# EAGLE design project1 (EAGLE 7.2.0)
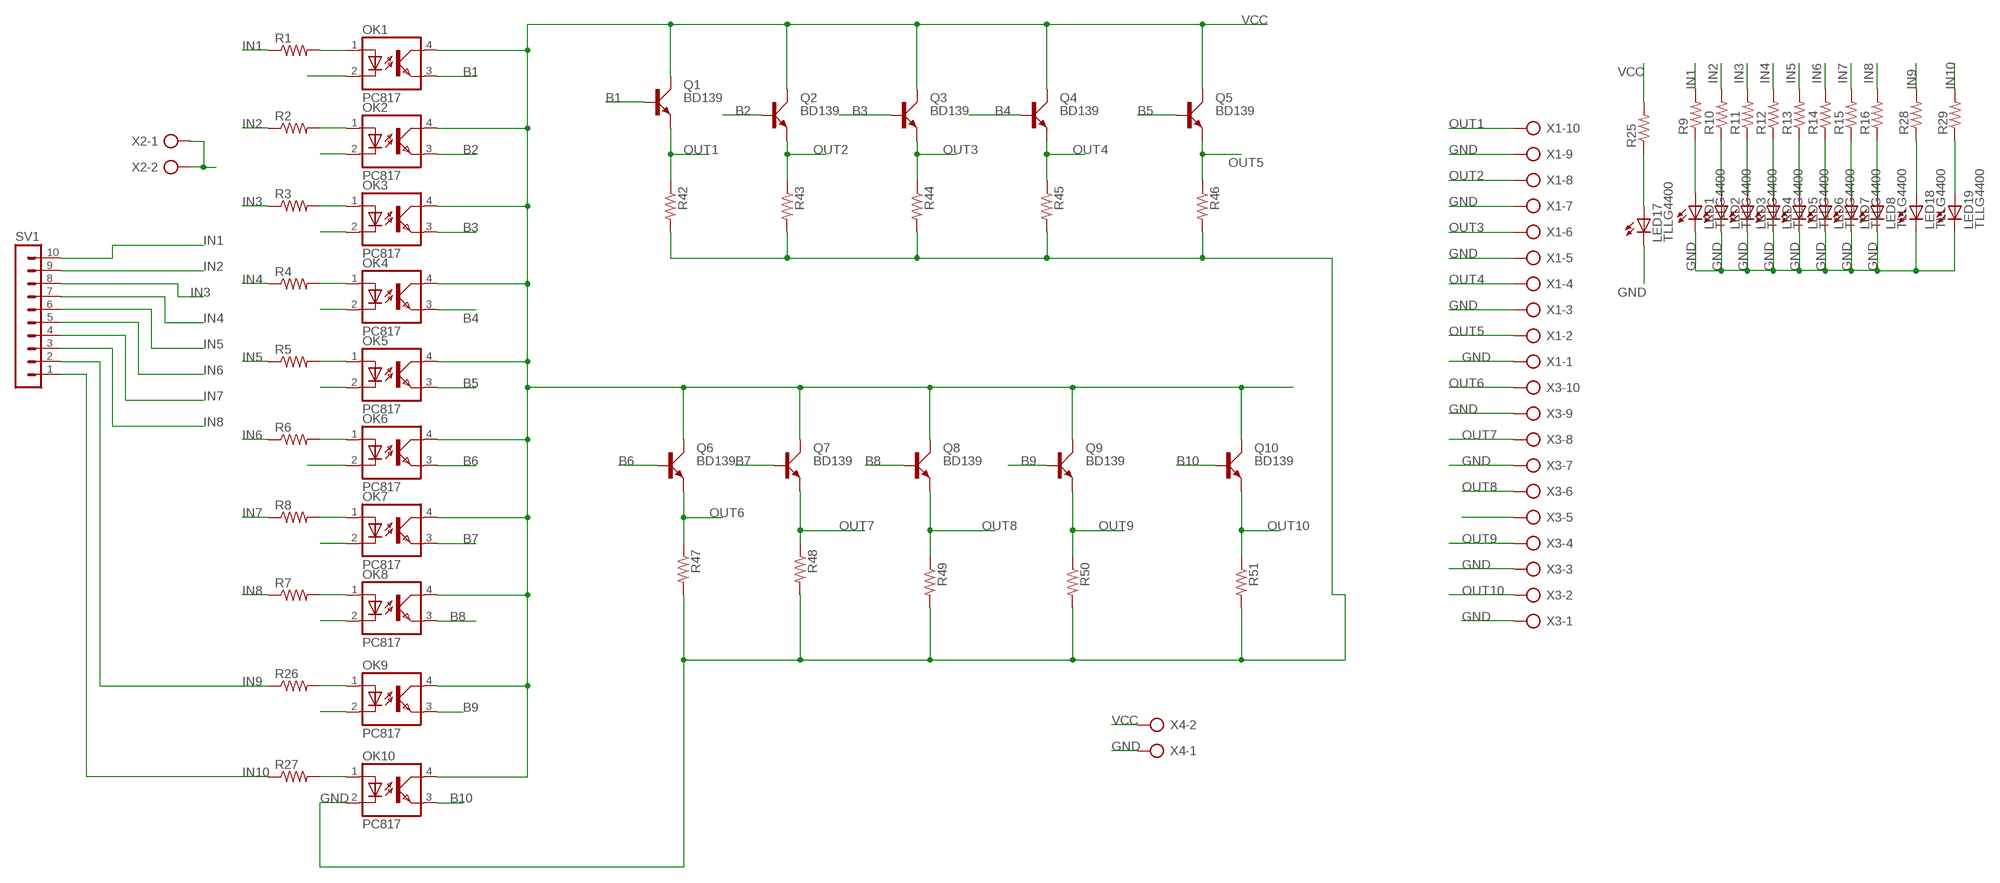
[diagram p0: schematic, sheet 1]

## Parts
LED1  TLLG4400  [LED3MM]
LED2  TLLG4400  [LED3MM]
LED3  TLLG4400  [LED3MM]
LED4  TLLG4400  [LED3MM]
LED5  TLLG4400  [LED3MM]
LED6  TLLG4400  [LED3MM]
LED7  TLLG4400  [LED3MM]
LED8  TLLG4400  [LED3MM]
LED17  TLLG4400  [LED3MM]
LED18  TLLG4400  [LED3MM]
LED19  TLLG4400  [LED3MM]
OK1  PC817  [DIL04]
OK2  PC817  [DIL04]
OK3  PC817  [DIL04]
OK4  PC817  [DIL04]
OK5  PC817  [DIL04]
OK6  PC817  [DIL04]
OK7  PC817  [DIL04]
OK8  PC817  [DIL04]
OK9  PC817  [DIL04]
OK10  PC817  [DIL04]
Q1  BD139  [TO126AV]
Q2  BD139  [TO126AV]
Q3  BD139  [TO126AV]
Q4  BD139  [TO126AV]
Q5  BD139  [TO126AV]
Q6  BD139  [TO126AV]
Q7  BD139  [TO126AV]
Q8  BD139  [TO126AV]
Q9  BD139  [TO126AV]
Q10  BD139  [TO126AV]
R1  R-US_0207/10  [0207/10]
R2  R-US_0207/10  [0207/10]
R3  R-US_0207/10  [0207/10]
R4  R-US_0207/10  [0207/10]
R5  R-US_0207/10  [0207/10]
R6  R-US_0207/10  [0207/10]
R7  R-US_0207/10  [0207/10]
R8  R-US_0207/10  [0207/10]
R9  R-US_0207/10  [0207/10]
R10  R-US_0207/10  [0207/10]
R11  R-US_0207/10  [0207/10]
R12  R-US_0207/10  [0207/10]
R13  R-US_0207/10  [0207/10]
R14  R-US_0207/10  [0207/10]
R15  R-US_0207/10  [0207/10]
R16  R-US_0207/10  [0207/10]
R25  R-US_0207/10  [0207/10]
R26  R-US_0207/10  [0207/10]
R27  R-US_0207/10  [0207/10]
R28  R-US_0207/10  [0207/10]
R29  R-US_0207/10  [0207/10]
R42  R-US_0207/10  [0207/10]
R43  R-US_0207/10  [0207/10]
R44  R-US_0207/10  [0207/10]
R45  R-US_0207/10  [0207/10]
R46  R-US_0207/10  [0207/10]
R47  R-US_0207/10  [0207/10]
R48  R-US_0207/10  [0207/10]
R49  R-US_0207/10  [0207/10]
R50  R-US_0207/10  [0207/10]
R51  R-US_0207/10  [0207/10]
SV1  MA10-1  [MA10-1]
X1  AK300/10  [AK300/10]
X2  AK300/2  [AK300/2]
X3  AK300/10  [AK300/10]
X4  AK300/2  [AK300/2]

## Nets
B1: OK1.3(EMIT) Q1.B
B2: OK2.3(EMIT) Q2.B
B3: OK3.3(EMIT) Q3.B
B4: OK4.3(EMIT) Q4.B
B5: OK5.3(EMIT) Q5.B
B6: OK6.3(EMIT) Q6.B
B7: OK7.3(EMIT) Q7.B
B8: OK8.3(EMIT) Q8.B
B9: OK9.3(EMIT) Q9.B
B10: OK10.3(EMIT) Q10.B
GND: LED1.K(C) LED2.K(C) LED3.K(C) LED4.K(C) LED5.K(C) LED6.K(C) LED7.K(C) LED8.K(C) LED17.K(C) LED18.K(C) LED19.K(C) OK1.2(C) OK2.2(C) OK3.2(C) OK4.2(C) OK5.2(C) OK6.2(C) OK7.2(C) OK8.2(C) OK9.2(C) OK10.2(C) R42.2 R43.2 R44.2 R45.2 R46.2 R47.2 R48.2 R49.2 R50.2 R51.2 X1.1 X1.3 X1.5 X1.7 X1.9 X2.1 X2.2 X3.1 X3.3 X3.5 X3.7 X3.9 X4.1
IN1: R1.1 R9.2 SV1.10
IN2: R2.1 R10.2 SV1.9
IN3: R3.1 R11.2 SV1.8
IN4: R4.1 R12.2 SV1.7
IN5: R5.1 R13.2 SV1.6
IN6: R6.1 R14.2 SV1.5
IN7: R8.1 R15.2 SV1.4
IN8: R7.1 R16.2 SV1.3
IN9: R26.1 R28.2 SV1.2
IN10: R27.1 R29.2 SV1.1
N$1: OK1.1(A) R1.2
N$2: OK2.1(A) R2.2
N$3: OK3.1(A) R3.2
N$4: OK4.1(A) R4.2
N$5: OK5.1(A) R5.2
N$6: OK6.1(A) R6.2
N$7: OK7.1(A) R8.2
N$8: OK8.1(A) R7.2
N$17: LED17.A R25.1
N$18: OK9.1(A) R26.2
N$19: OK10.1(A) R27.2
N$21: LED18.A R28.1
N$22: LED19.A R29.1
N$49: LED1.A R9.1
N$50: LED2.A R10.1
N$51: LED3.A R11.1
N$52: LED4.A R12.1
N$53: LED5.A R13.1
N$54: LED6.A R14.1
N$55: LED7.A R15.1
N$56: LED8.A R16.1
OUT1: Q1.E R42.1 X1.10
OUT2: Q2.E R43.1 X1.8
OUT3: Q3.E R44.1 X1.6
OUT4: Q4.E R45.1 X1.4
OUT5: Q5.E R46.1 X1.2
OUT6: Q6.E R47.1 X3.10
OUT7: Q7.E R48.1 X3.8
OUT8: Q8.E R49.1 X3.6
OUT9: Q9.E R50.1 X3.4
OUT10: Q10.E R51.1 X3.2
VCC: OK1.4(COL) OK2.4(COL) OK3.4(COL) OK4.4(COL) OK5.4(COL) OK6.4(COL) OK7.4(COL) OK8.4(COL) OK9.4(COL) OK10.4(COL) Q1.C Q2.C Q3.C Q4.C Q5.C Q6.C Q7.C Q8.C Q9.C Q10.C R25.2 X4.2

## Library data of the parts
LED1-LED8 LED17-LED19 = led:TLLG4400: Low Current (2mA) LED 3 mm Tinted Diffused Package color GREEN Source: Data sheet <http://www.farnell.com/datasheets/391098.pdf>; MF: VISHAY SEMICONDUCTOR; OC_FARNELL: 1612435
OK1-OK10 = optocoupler:PC817: SHARP OPTO COUPLER; MPN: PC817X4J000F; OC_FARNELL: 9707727; OC_NEWARK: 97K7059
Q1-Q10 = transistor-power:BD139: NPN TRANSISTOR
R1 R42-R51 = resistor:R-US_: RESISTOR, American symbol
R2-R16 R25-R29 = rcl:R-US_: RESISTOR, American symbol
SV1 = con-lstb:MA10-1: PIN HEADER; OC_FARNELL: unknown; OC_NEWARK: unknown
X1 X3 = con-ptr500:AK300/10: CONNECTOR; OC_FARNELL: unknown; OC_NEWARK: unknown
X2 X4 = con-ptr500:AK300/2: CONNECTOR; OC_FARNELL: unknown; OC_NEWARK: unknown

## Net classes
0 default: width 0.406 mm

## Board
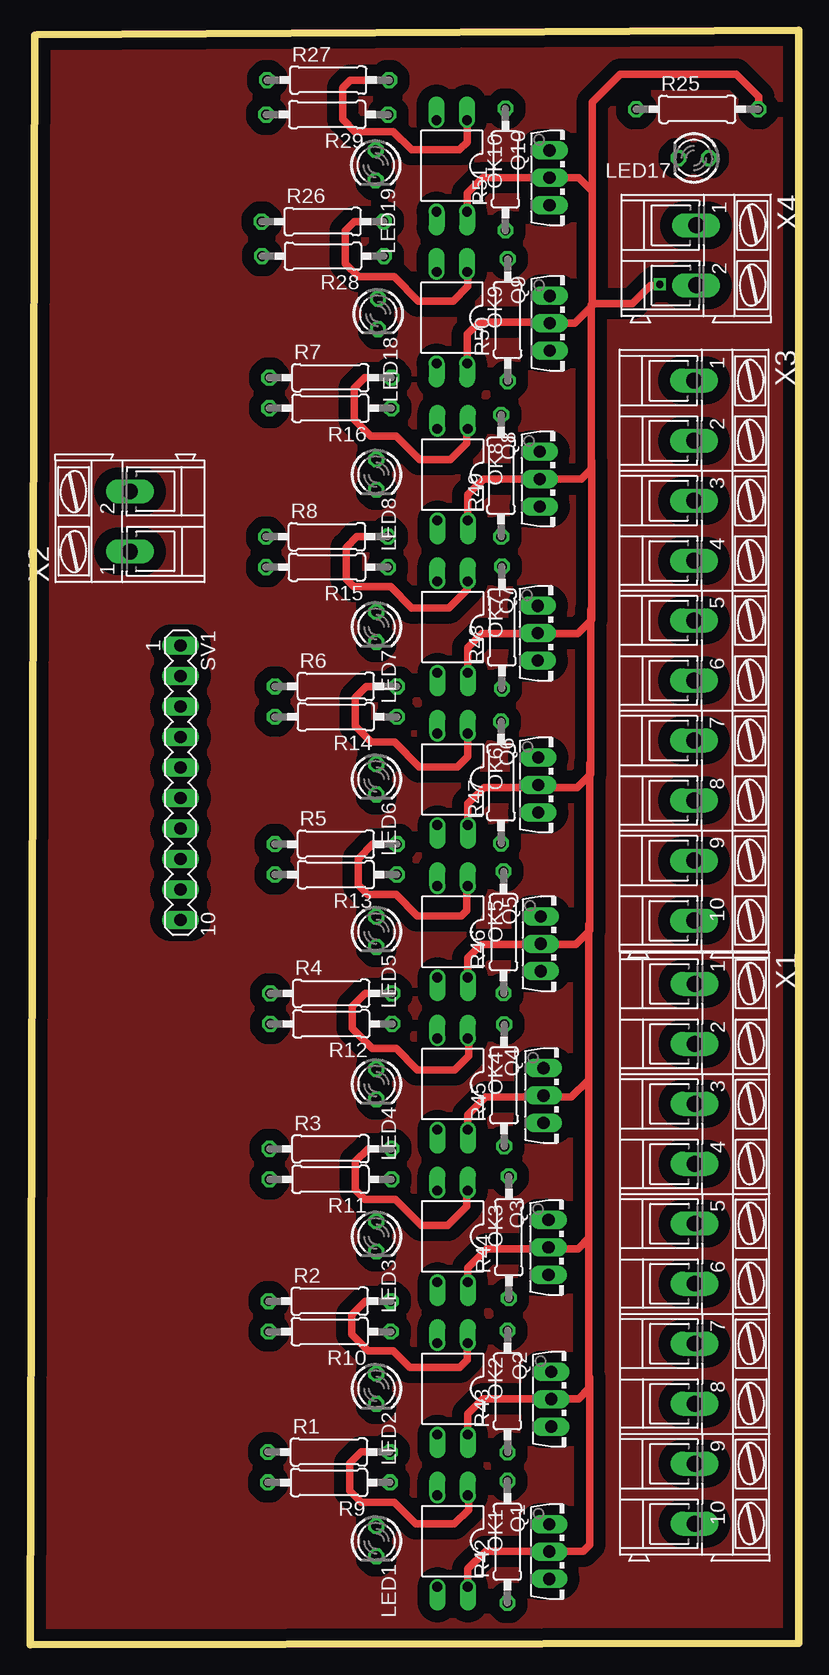
[diagram p1: board, top side]
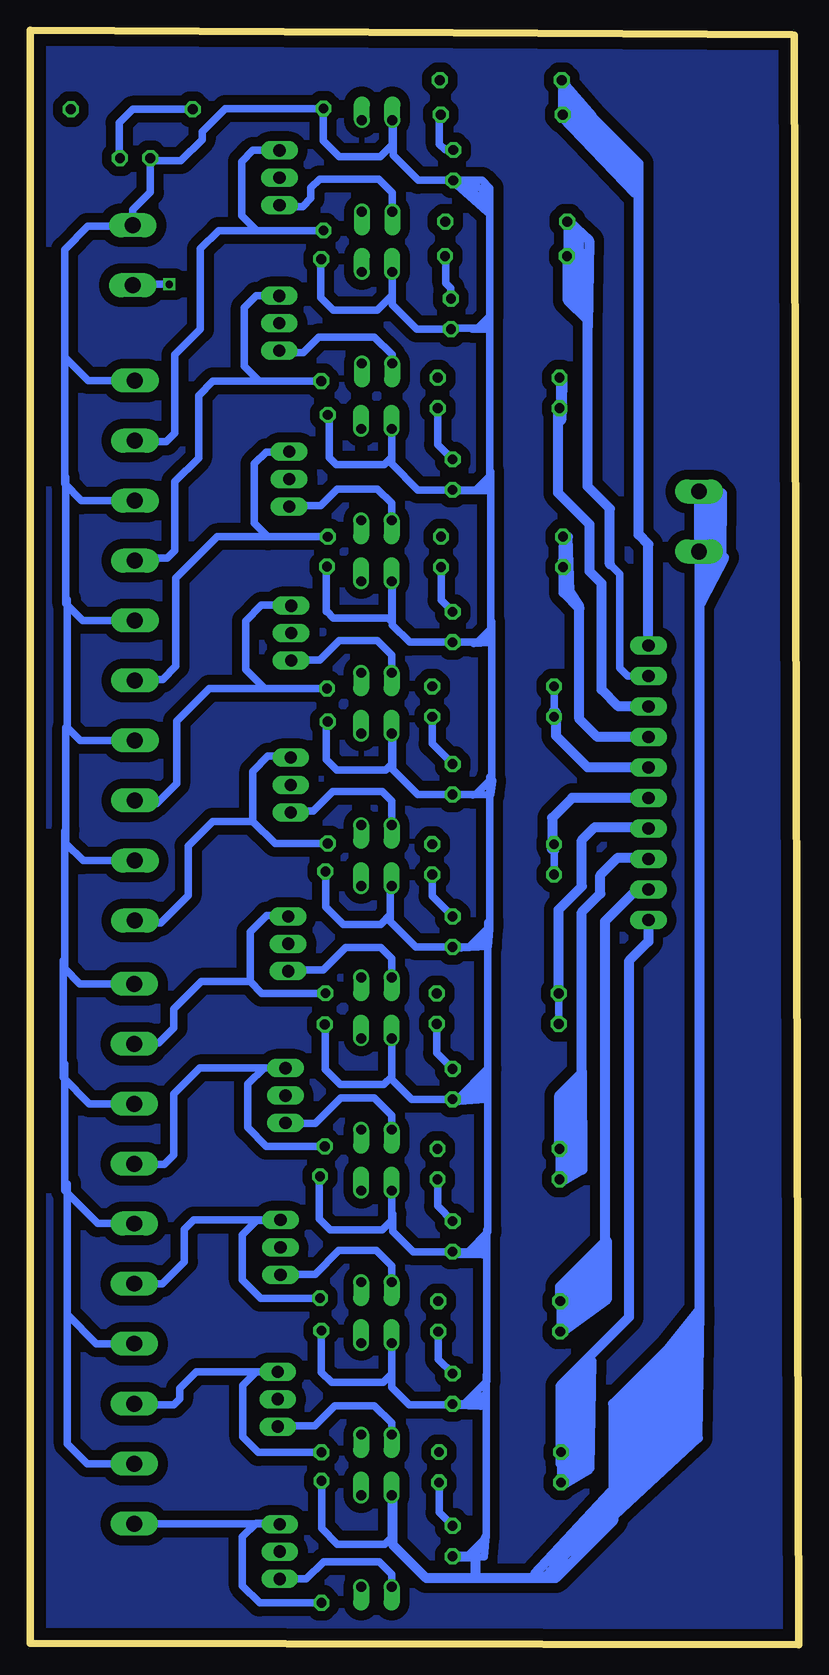
[diagram p2: board, bottom side, seen from below]

Size 64.08 x 134.59 mm. Coordinates in mm from the lower left corner, seen from the top.
Outline: 0.59,134.19 64.04,134.59 64.08,0.13 0,0 0.41,134.14
Copper layers (1*16): Top 0.035mm / dielectric 1.5mm / Bottom 0.035mm
Design rules "default": minimum track width 10mil, minimum drill 24mil, track to track 8mil, track to pad 8mil, pad to pad 8mil, via to via 8mil, smd to smd 8mil, copper to edge 40mil, drill to drill 8mil, minimum pad ring 10mil, minimum via ring 8mil, stop-mask expansion 4mil, vias tented up to drill 0mil, thermal gap 10mil

### Footprints (pad centres in the part's own frame; a part is rotated, then mirrored left to right if it is on the bottom)
LED3MM = drill 0.813 octagon: A -1.27,0; K 1.27,0
DIL04 = drill 0.813 offset: 1 -1.27,-3.81; 2 1.27,-3.81; 3 1.27,3.81; 4 -1.27,3.81
TO126AV = drill 1.016 long: B 2.286,-1.27; C 0,-1.27; E -2.286,-1.27
0207/10 = drill 0.813 octagon: 1 -5.08,0; 2 5.08,0
MA10-1 = drill 1.016 long: 1 -11.43,0; 2 -8.89,0; 3 -6.35,0; 4 -3.81,0; 5 -1.27,0; 6 1.27,0; 7 3.81,0; 8 6.35,0; 9 8.89,0; 10 11.43,0
AK300/10 = drill 1.321 long: 1 -22.504,0; 2 -17.501,0; 3 -12.497,0; 4 -7.493,0; 5 -2.515,0; 6 2.489,0; 7 7.493,0; 8 12.497,0; 9 17.501,0; 10 22.504,0
AK300/2 = drill 1.321 long: 1 -2.515,0; 2 2.489,0

### Placement (x,y rotation side)
LED1  28.86,8.63 270 top
LED2  28.86,21.33 270 top
LED3  28.86,34.03 270 top
LED4  28.86,46.73 270 top
LED5  28.86,59.43 270 top
LED6  28.86,72.13 270 top
LED7  28.86,84.83 270 top
LED8  28.86,97.53 270 top
LED17  55.32,123.91 180 top
LED18  29,110.93 270 top
LED19  28.8,123.33 270 top
OK1  35.21,8.63 180 top
OK2  35.21,21.33 180 top
OK3  35.21,34.03 180 top
OK4  35.21,46.73 180 top
OK5  35.21,59.43 180 top
OK6  35.21,72.13 180 top
OK7  35.21,84.83 180 top
OK8  35.21,97.53 180 top
OK9  35.16,110.61 180 top
OK10  35.15,123.27 180 top
Q1  44.53,7.76 270 top
Q2  44.7,20.46 270 top
Q3  44.48,33.11 270 top
Q4  44.06,45.77 270 top
Q5  43.84,58.42 270 top
Q6  43.62,71.66 270 top
Q7  43.59,84.31 270 top
Q8  43.75,97.16 270 top
Q9  44.57,110.15 270 top
Q10  44.56,122.27 270 top
R1  24.91,16.06 0 top
R2  24.97,28.63 0 top
R3  25.04,41.33 0 top
R4  25.1,54.28 0 top
R5  25.49,66.73 0 top
R6  25.49,79.88 0 top
R7  25.03,105.61 0 top
R8  24.74,92.36 0 top
R9  24.91,13.52 180 top
R10  24.97,26.09 180 top
R11  25.04,38.79 180 top
R12  25.1,51.74 180 top
R13  25.49,64.19 180 top
R14  25.49,77.34 180 top
R15  24.74,89.82 180 top
R16  25.03,103.07 180 top
R25  55.6,127.99 0 top
R26  24.39,118.62 0 top
R27  24.85,130.41 0 top
R28  24.42,115.74 180 top
R29  24.77,127.54 180 top
R42  39.79,8.57 90 top
R43  39.79,21.1 90 top
R44  39.91,33.96 90 top
R45  39.51,46.62 90 top
R46  39.46,59.38 90 top
R47  39.26,71.86 90 top
R48  39.33,84.79 90 top
R49  39.26,97.43 90 top
R50  39.81,110.41 90 top
R51  39.62,122.96 90 top
SV1  12.54,71.85 270 top
X1  55.39,32.58 270 top
X2  8.33,93.64 90 top
X3  55.34,82.86 270 top
X4  55.51,115.8 270 top

### Tracks (layer width: path | path; a pad name or v marks a point on that pad's centre or on a via)
B1
  Bottom 0.61: OK1.3 33.94,5.86 34.99,6.91 39.61,6.91 41.04,5.47 Q1.B | Q1.B
B2
  Bottom 0.61: OK2.3 33.94,18.5 35.37,19.92 38.68,19.92 40.36,18.25 43.35,18.25 Q2.B
B3
  Bottom 0.61: OK3.3 33.94,31.58 35.22,32.86 38.34,32.86 40.32,30.88 43.15,30.88 Q3.B
B4
  Bottom 0.61: OK4.3 33.94,44.13 35.37,45.56 38.19,45.56 40.32,43.43 42.74,43.43 Q4.B
B5
  Bottom 0.61: OK5.3 33.94,57.21 34.84,58.11 37.77,58.11 39.63,56.25 42.46,56.25 Q5.B
B6
  Bottom 0.61: OK6.3 33.94,70.33 34.72,71.11 38.87,71.11 40.49,69.49 42.23,69.49 Q6.B
B7
  Bottom 0.61: OK7.3 33.94,82.5 35.13,83.69 38.3,83.69 39.92,82.06 42.28,82.06 Q7.B
B8
  Bottom 0.61: OK8.3 33.94,95.16 35.13,96.34 38.46,96.34 39.84,94.96 42.4,94.96 Q8.B
B9
  Bottom 0.406: Q9.B 43.14,107.7
  Bottom 0.61: OK9.3 33.89,107.52 35.37,109 40.01,109 41.3,107.7 43.14,107.7
B10
  Bottom 0.61: OK10.3 33.88,121.02 35.03,122.16 39.94,122.16 40.66,121.44 40.66,120.56 41.35,119.88 43.19,119.88 Q10.B
GND
  Bottom 0.61: 25.76,110.72 25.76,121.42 26.4,122.06 LED19.K 31.73,122.06 33.81,124.14 33.81,127 OK10.2 33.88,125.03 34.9,124.02 38.31,124.02 39.63,125.35 39.63,128.03 R51.2 47.8,128.04 49.74,126.11 49.74,125.47 51.5,123.7 53.84,123.7 LED17.K 54.05,121.06 55.51,119.6 X4.1 55.61,118.22 59.27,118.22 61.2,116.29 61.2,107.33 | 25.76,110.72 26.76,109.72 28.94,109.72 LED18.K 31.84,109.66 33.89,111.7 OK9.2 33.89,112.51 35.16,111.24 38.79,111.24 39.84,112.28 39.84,115.46 R50.2 | 25.76,97.88 25.76,97.42 26.92,96.26 LED8.K 31.76,96.26 33.92,98.43 33.92,101.32 OK8.2 33.94,98.98 34.54,98.37 38.57,98.37 39.16,98.97 39.16,102.41 R49.2 | 25.76,97.88 25.76,110.72 | 25.69,85.34 25.69,84.65 26.77,83.56 LED7.K 32.44,83.56 33.89,85 33.89,85.24 | 25.69,85.34 25.69,97.8 25.76,97.88 | 25.61,72.49 25.61,72.18 26.93,70.86 LED6.K 31.76,70.86 33.85,72.94 33.85,75.85 OK6.2 33.94,73.42 34.45,72.91 38.52,72.91 39.39,73.77 39.39,76.81 R47.2 | 25.61,72.49 25.61,85.26 25.69,85.34 | 25.76,60.34 25.76,59.87 27.48,58.16 LED5.K 31.92,58.16 34.04,60.28 34.04,60.86 | 25.76,60.34 25.76,72.34 25.61,72.49 | 25.92,48.03 28.49,45.46 LED4.K 32.26,45.46 33.92,47.12 33.92,50.52 OK4.2 33.94,47.32 34.58,46.68 38.22,46.68 39.48,47.94 39.48,51.67 R45.2 | 25.92,48.03 25.92,60.18 25.76,60.34 | 25.92,34.64 25.92,34.41 27.57,32.76 LED3.K 32.15,32.76 33.85,34.45 33.85,35.92 33.94,36.01 | 25.92,34.64 25.92,48.03 | 25.99,22.56 25.99,21.95 27.88,20.06 LED2.K 28.92,20 32.48,20 33.94,21.46 33.94,22.56 | 25.99,22.56 25.99,34.57 25.92,34.64 | LED1.K 27.66,7.36 26.07,8.95 26.07,22.49 25.99,22.56 | X3.1 59.24,105.37 61.2,107.33
  Bottom 0.61: X3.3 59.79,95.36 61.2,96.77 61.2,97.45 | 61.2,97.45 61.2,107.33 | X3.5 59.69,85.38 61.09,86.78 61.09,87.23 | 61.09,87.23 61.09,97.33 61.2,97.45 | X3.7 59.9,75.37 60.97,76.45 60.97,76.56 | 60.97,76.56 60.97,87.12 61.09,87.23 | X3.9 59.65,65.36 61.09,66.8 61.09,67.93 | 61.09,67.93 61.09,76.45 60.97,76.56 | X1.1 59.93,55.09 61.2,56.35 61.2,57.15 | 61.2,57.15 61.2,67.82 61.09,67.93 | X1.3 59.12,45.08 61.31,47.27 61.31,48.52 | 61.31,48.52 61.31,57.03 61.2,57.15 | X1.5 58.45,35.1 61.2,37.85 61.2,38.64 | 61.2,38.64 61.2,48.4 61.31,48.52 | X1.7 58.55,25.09 60.97,27.51 | 60.97,27.51 60.97,38.41 61.2,38.64 | X1.9 59.32,15.08 60.97,16.73 60.97,27.51 | OK1.2 33.94,8.95 34.53,8.36 38.45,8.36 39.79,9.69 R42.2 | R42.2 | OK2.2 33.94,22.56 | 33.94,22.56 34.64,21.86 38.95,21.86 39.81,22.72 39.81,26.17 R43.2 | R44.2 39.97,38.98 39.97,35.49 39.05,34.57 34.74,34.57 33.94,35.36 33.94,36.01 | 33.89,85.24 33.89,88.58 OK7.2 33.94,85.51 | OK5.2 34.04,63.14 34.04,60.86 | 33.94,36.01 OK3.2 | R48.2 39.39,89.81 39.39,86.1 39.31,86.1 38.79,85.57 34.22,85.57 33.89,85.24 | 34.04,60.86 34.86,60.03 37.97,60.03 39.43,61.49 39.43,64.43 R46.2
  Bottom 0.813: X2.1 X2.2 8.33,27.25 15.49,20.09 15.49,10.33 20.28,5.54 26.96,5.54 | 26.96,5.54 31.05,5.54 33.84,8.33 33.84,12.34 OK1.2 | LED1.K 26.96,7.36 26.96,5.54
IN1
  Bottom 0.61: R1.1 19.83,15.05 R9.2
  Bottom 0.813: SV1.10 12.54,58.61 14.16,56.98 14.16,27.29 19.88,21.57 19.88,15.1 19.83,15.05
IN2
  Bottom 0.61: R2.1 R10.2
  Bottom 0.813: R2.1 19.89,29.86 17.01,32.74 16.63,33.13 16.16,33.59 16.16,60.29 13.5,62.96 SV1.9
IN3
  Bottom 0.61: R3.1 R11.2
  Bottom 0.813: R3.1 19.96,45.8 18.09,47.67 18.09,61.06 16.55,62.6 16.55,64.14 15.09,65.6 12.64,65.6 SV1.8
IN4
  Bottom 0.61: R4.1 R12.2
  Bottom 0.813: R4.1 20.02,61.28 18.09,63.22 18.09,67.06 17.01,68.14 12.64,68.14 SV1.7
IN5
  Bottom 0.61: R5.1 20.41,66.16 R13.2
  Bottom 0.813: SV1.6 18.91,70.58 20.56,68.92 20.56,66.32 20.41,66.16
IN6
  Bottom 0.61: R6.1 20.41,77.85 R14.2
  Bottom 0.813: SV1.5 17.62,73.12 20.24,75.74 20.24,77.68 20.41,77.85
IN7
  Bottom 0.61: R8.1 19.66,90.38 R15.2
  Bottom 0.813: SV1.4 16.81,75.66 18.29,77.14 18.29,86.38 19.6,87.69 19.6,90.32 19.66,90.38
IN8
  Bottom 0.61: R7.1 R16.2
  Bottom 0.813: SV1.3 15.04,78.2 16.45,79.61 16.45,88.46 17.45,89.46 17.45,93.38 20.06,96 20.06,102.96 R16.2
IN9
  Bottom 0.61: R26.1 19.31,115.77 R28.2 | 13.73,80.74 14.26,80.74 14.91,81.39 14.91,89.23 15.75,90.07
  Bottom 0.813: SV1.2 13.73,80.74 | 15.75,90.07 15.75,94.69 17.6,96.54 17.6,110.39 19.26,112.05 19.26,115.67 R28.2
IN10
  Bottom 0.61: R27.1 19.77,127.62 R29.2
  Bottom 0.813: SV1.1 12.54,91.7 13.35,92.52 13.35,123.46 17.34,127.44 19.59,127.44 R29.2
N$1
  Top 0.61: R1.2 27.62,16.06 26.65,15.09 26.65,12.81 27.61,11.86 30.35,11.86 32.14,10.07 35.37,10.07 36.55,11.25 36.55,12.37 OK1.1
N$2
  Top 0.61: R2.2 27.94,28.63 26.81,27.49 26.81,25.86 28.18,24.49 30.27,24.49 31.64,23.12 35.83,23.12 36.44,23.73 36.44,25.09 OK2.1
N$3
  Top 0.61: R3.2 28.17,41.33 27.11,40.27 27.11,37.92 27.91,37.12 30.42,37.12 32.59,34.95 34.8,34.95 36.4,36.55 36.4,37.76 OK3.1
N$4
  Top 0.61: R4.2 27.93,54.29 26.84,53.2 26.84,51.38 28.52,49.71 30.5,49.71 32.29,47.92 35.41,47.92 36.55,49.06 36.55,50.47 OK4.1
N$5
  Top 0.61: R5.2 28.58,66.73 27.34,65.49 27.34,63.32 28.14,62.52 30.5,62.52 32.29,60.74 35.94,60.74 36.4,61.19 36.4,63.16 OK5.1
N$6
  Top 0.61: R6.2 28.03,79.88 27.11,78.95 27.11,76.56 28.44,75.23 30.39,75.23 32.44,73.17 35.6,73.17 36.47,74.05 OK6.1
N$7
  Top 0.61: R8.2 27.24,92.36 26.35,91.47 26.35,88.81 26.96,88.2 30.04,88.2 31.83,86.41 34.92,86.41 36.44,87.93 36.44,88.59 OK7.1
N$8
  Top 0.61: R7.2 27.9,105.61 27.03,104.74 27.03,102.12 28.41,100.75 30.5,100.75 32.48,98.77 35.03,98.77 36.4,100.14 36.4,101.26 OK8.1
N$17
  Bottom 0.61: R25.1 55.53,127.99 56.66,126.85 56.66,123.99 LED17.A
N$18
  Top 0.61: R26.2 27.03,118.62 26.27,117.86 26.27,115.13 27.38,114.02 30.35,114.02 32.36,112.01 35.26,112.01 36.47,113.22 36.47,114.38 OK9.1
N$19
  Top 0.61: R27.2 26.69,130.42 26.05,129.77 26.05,127.14 27.07,126.12 30.27,126.12 31.79,124.6 35.79,124.6 36.44,125.24 36.44,127.07 OK10.1
N$20
  Bottom 0.813: 17.22,127.38 19.72,130.24 19.2,127.85 18.68,127.9 19.1,128.47
N$21
  Bottom 0.61: LED18.A 29,113.08 29.43,113.5 29.43,115.67 R28.1
N$22
  Bottom 0.61: LED19.A 29.47,124.6 29.96,125.09 29.96,127.42 R29.1
N$23
  Bottom 0.813: 19.2,118.6 17.49,117.04 17.59,109.87
N$24
  Bottom 0.813: 18.73,118.03 18.47,111.53 17.95,111.43 18.37,117.14
N$25
  Bottom 0.813: 19.72,105.66 19.77,103.06 19.83,102.07
N$26
  Bottom 0.813: 18.32,86.59 19.1,87.78 19.25,92.35 19.62,92.35 19.67,89.55
N$27
  Bottom 0.813: 18.11,47.87 18.06,39.61 19.77,38.62 19.41,45.58 18.68,46.36 18.68,39.87 19.1,39.4 18.79,45.58
N$28
  Bottom 0.813: 16.03,33.68 16.03,28.74 19.83,25.99 19.51,29.78 16.34,32.59 16.39,28.9 18.99,26.87 19.15,29.58 17.07,31.55 17.02,29.32 18.42,27.76 18.53,29.42 17.69,30.25 17.75,29.11 18.06,28.74
N$29
  Bottom 0.813: 19.67,13.36 17.43,14.71 17.28,23.65 19.2,21.16 19.31,14.19 17.95,15.28 18.16,22.56 18.84,14.71 18.99,21.47
N$30
  Bottom 0.813: 15.66,12.73 22.04,5.81 21.05,5.63 16.02,11.56 15.75,10.75 18.63,7.51
N$31
  Bottom 0.813: 8.06,95.97 6.41,95.97 6.49,90.57 8.28,90.5 8.13,95.29 7.39,95.34 6.92,95.22 6.94,91.41 7.42,91.53 7.6,95.42 7.29,94.72 7.32,93.39 7.42,91.46 7.62,91.23 7.92,93.66 7.7,94.84
N$32
  Bottom 0.813: 6.23,90.62 8.18,86.86 7.79,90.49 6.88,90.28 7.57,88.76 7.44,90.32 8.18,91.06 8.22,91.32
N$45
  Bottom 0.813: 15.4,10.79 8.43,17.24 8.28,27.95 15.25,19.18 14.95,11.99 8.73,17.39 8.81,26.08 14.57,18.81 14.72,12.82 9.18,17.91
  Bottom 1.422: 9.18,17.91 9.7,24.35 14.2,17.76 14.27,14.09 9.63,18.58 10.9,21.58 10.23,22.55 13.22,16.19 13.52,17.91 10.23,19.11 11.95,17.24
N$46
  Bottom 0.813: 19.72,127.36 13.66,121 14.03,123.17 17.7,127.14 18.52,126.92 14.4,122.8 14.33,122.27
N$47
  Bottom 0.61: 28.88,121.98 25.99,119.42 26.39,121.4 28.37,121.73 26.28,120.39 27.18,121.15
N$48
  Bottom 0.61: 27.22,109.64 25.92,109.64
N$49
  Bottom 0.61: R9.1 29.99,11.03 LED1.A
N$50
  Bottom 0.61: R10.1 30.05,23.79 LED2.A
N$51
  Bottom 0.61: R11.1 30.12,36.56 LED3.A
N$52
  Bottom 0.61: R12.1 30.18,49.32 LED4.A
N$53
  Bottom 0.61: R13.1 30.57,62.41 LED5.A
N$54
  Bottom 0.61: R14.1 30.57,75.11 LED6.A
N$55
  Bottom 0.61: R15.1 29.82,87.06 LED7.A
N$56
  Bottom 0.61: R16.1 30.11,100.05 LED8.A
N$57
  Bottom 0.61: 28.95,96.18 26.06,96.18 26.24,96.54
N$58
  Bottom 0.61: 27.11,83.45 25.77,83.52 25.88,83.99
N$59
  Bottom 0.61: 27.18,70.82 25.67,70.86 25.52,72.05
N$60
  Bottom 0.61: 28.12,58.08 25.88,58.19 25.77,59.67 26.57,58.41
N$61
  Bottom 0.61: 28.84,45.24 26.14,45.46 26.14,47.19 28.05,45.42 26.42,45.74 26.61,46.18 27.54,45.64
N$62
  Bottom 0.61: 28.95,32.54 26.35,32.5 26.35,33.73 27.25,32.68 26.82,32.79
N$63
  Bottom 0.61: 28.7,19.95 26.5,19.88 26.28,20.78 27.18,20.2
N$64
  Bottom 0.61: 28.88,7.25 26.24,7.32 26.06,9.2 26.86,7.65 27.8,7.39
N$116
  pour Bottom (isolate 0.813): 0.82,134.38 64.78,133.98 64.1,-0.07 -0.18,-0.21 0.64,134.79
N$117
  pour Top (isolate 1.016): 1.5,134.25 64.84,133.92 64.29,-0.26 -0.18,-0.13 0.5,134.25
OUT1
  Bottom 0.61: R42.1 44.94,3.49 46.38,4.93 46.38,8.98 45.23,10.13 43.88,10.13 | 43.88,10.13 43.35,10.13 Q1.E | X1.10 43.93,10.08 43.88,10.13
OUT2
  Bottom 0.61: R43.1 45.05,16.02 46.33,17.31 46.33,21.63 45.23,22.73 43.45,22.73 Q2.E 50.21,22.75 51.61,21.35 51.61,20.48 52.09,20.01 55.31,20.01 X1.8
OUT3
  Bottom 0.61: R44.1 44.87,28.88 46.38,30.4 46.38,34.18 45.18,35.38 44.67,35.38 | 44.67,35.38 43.22,35.38 Q3.E | X1.6 53.05,30.09 51.22,31.92 51.22,34.61 50.43,35.4 44.68,35.4 44.67,35.38
OUT4
  Bottom 0.61: R45.1 44.38,41.54 45.95,43.11 45.95,46.72 44.57,48.09 42.83,48.09 Q4.E 49.92,48.05 52.09,45.89 52.09,40.84 52.88,40.05 55.36,40.05 X1.4
OUT5
  Bottom 0.61: R46.1 44.76,54.3 45.73,55.27 | 45.73,55.27 45.73,59.43 44.36,60.8 42.66,60.8 Q5.E | 45.73,55.27 49.82,55.27 52.09,52.99 52.09,51.42 53.35,50.15 55.32,50.15 X1.2
OUT6
  Bottom 0.61: R47.1 43.66,66.79 45.51,68.63 | 45.51,68.63 45.51,72.79 44.25,74.05 42.46,74.05 Q6.E | 45.51,68.63 48.84,68.63 50.9,66.57 50.9,62.46 53.19,60.17 55.15,60.17 X3.10
OUT7
  Bottom 0.61: R48.1 44.53,79.71 | 44.53,79.71 46.11,81.28 46.11,85.34 44.79,86.65 42.37,86.65 Q7.E | 44.53,79.71 49.13,79.71 51.85,76.98 51.85,71.78 53.51,70.12 55.09,70.12 X3.8
OUT8
  Bottom 0.61: Q8.E 42.52,99.42 44.41,99.42 45.4,98.43 45.4,93.5 44.25,92.35 R49.1 48.48,92.35 51.93,88.9 51.93,81.56 53.03,80.46 55.25,80.46 X3.6
OUT9
  Bottom 0.61: R50.1 44.96,105.33 | 44.96,105.33 46.22,106.59 46.22,111.46 45.23,112.45 43.32,112.45 Q9.E | 44.96,105.33 48.83,105.33 50.04,104.13 50.04,98.92 52.01,96.95 52.01,91.19 52.64,90.56 55.14,90.56 X3.4
OUT10
  Bottom 0.61: R51.1 45.19,117.88 | 45.19,117.88 46.44,119.13 46.44,123.63 45.51,124.56 Q10.E | 45.19,117.88 48.36,117.88 49.88,116.36 49.88,109.65 52.01,107.52 52.01,100.97 52.72,100.26 55.23,100.26 X3.2
VCC  (via drill 0.6)
  Top 0.61: OK10.4 36.42,120.97 37.73,122.28 Q10.C 43.31,122.29 45.71,122.29 46.86,121.15 | OK9.4 36.43,109.22 37.46,110.26 43.2,110.26 Q9.C 45.39,110.15 46.86,111.61 46.86,111.79 | OK8.4 36.48,95.85 37.81,97.17 42.48,97.17 | 42.48,97.17 Q8.C | OK7.4 36.48,83.11 37.65,84.28 42.28,84.28 | 42.28,84.28 Q7.C | OK6.4 36.48,70.1 37.84,71.46 42.15,71.46 | 42.15,71.46 Q6.C | OK5.4 36.48,57.24 37.62,58.38 42.52,58.38 | 42.52,58.38 Q5.C | OK4.4 36.48,44.16 37.96,45.64 42.66,45.64 | 42.66,45.64 Q4.C | OK3.4 36.48,31.42 38.07,33.01 43.1,33.01 | 43.1,33.01 Q3.C | OK2.4 36.48,19.25 37.73,20.5 43.4,20.5 | 43.4,20.5 Q2.C | OK1.4 36.48,6.31 37.96,7.79 43.23,7.79 | 43.23,7.79 Q1.C | 46.86,111.79 46.86,121.15 | 42.48,97.17 45.93,97.17 46.77,98.01 46.77,98.69 | 46.77,98.69 46.77,111.7 46.86,111.79 | 42.28,84.28 45.65,84.28 46.8,85.43 46.8,86.37 | 46.8,86.37 46.8,98.65 46.77,98.69 | 42.15,71.46 45.62,71.46 46.72,72.56 46.72,73.51 | 46.72,73.51 46.72,86.3 46.8,86.37 | 42.52,58.38 45.48,58.38 46.64,59.54 46.64,60.1 | 46.64,60.1 46.64,73.43 46.72,73.51 | 42.66,45.64 45.12,45.64 46.56,47.07 | 46.56,47.07 46.56,60.02 46.64,60.1 | 43.1,33.01 45.67,33.01 46.56,33.9 | 46.56,33.9 46.56,47.07 | 43.4,20.5 45.71,20.5 46.56,21.35 46.56,22.37 | 46.56,22.37 46.56,33.9 | 43.23,7.79 46.11,7.79 46.64,8.33 46.64,22.3 46.56,22.37 | 46.86,111.79 50.2,111.79 51.69,113.28 52.37,113.28 v52.47,113.39 | 46.86,121.15 46.86,128.59 49.19,130.92 58.87,130.92 60.74,129.05 60.74,128.05 R25.2
  Bottom 0.406: X4.2 55.43,113.39
  Bottom 0.61: 55.43,113.39 v52.47,113.39

### Text on the board
tTest: GND | VCC | 10 | Arduino | GND | 1 | 2 | 3 | 4 | 5 | 6 | 7 | 8 | 9 | 10 | INPUT | 1 | OUTPUT